# Altium schematic sheet Sheet2.SchDoc
size A
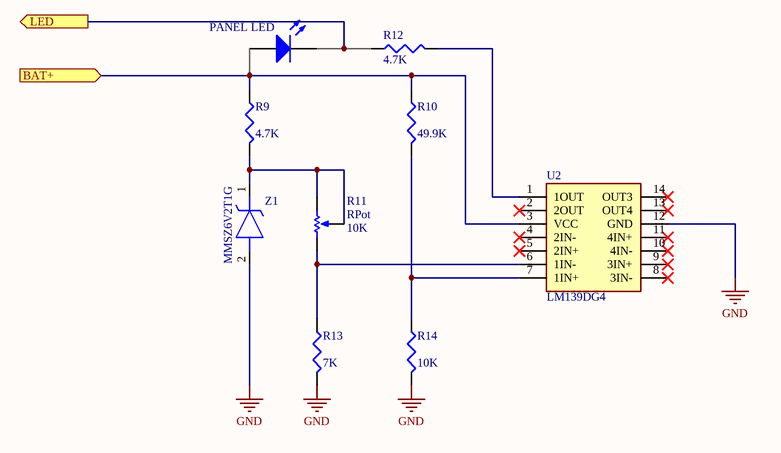
[diagram p0: Sheet2.SchDoc]

## Parts
D5  PANEL LED  [LED-1]  (graphical)
R9  value 4.7K  [RESC1608X55N]  (hidden comment: Res3)
R10  value 49.9K  [RESC1608X55N]  (hidden comment: Res3)
R11  RPot  value 10K  [Bourns_Pot]
R12  value 4.7K  [RESC1608X55N]  (hidden comment: Res3)
R13  value 7K  [RESC1608X55N]  (hidden comment: Res3)
R14  value 10K  [RESC1608X55N]  (hidden comment: Res3)
U2  LM139DG4  [SOIC127P600X175-14N]
Z1  MMSZ6V2T1G  [SOD3716X135N]

## Ports
BAT+ (in), LED (out)

## Nets
GND: R13.2 R14.2 U2.12(GND) Z1.2(A)
BAT+: D5.1(A) R9.1 R10.1 U2.3(VCC) ; port BAT+
LED: D5.2(K) R12.1 ; port LED
NetR9_2: R9.2 R11.2(BOT) R11.3(TAP) Z1.1(K)
NetR10_2: R10.2 R14.1 U2.7(1IN+)
NetR11_1: R11.1(TOP) R13.1 U2.6(1IN-)
NetR12_2: R12.2 U2.1(1OUT)

Not connected (* = marked no-connect by the designer): U2 2(2OUT)* 4(2IN-)* 5(2IN+)* 8(3IN-)* 9(3IN+)* 10(4IN-)* 11(4IN+)* 13(OUT4)* 14(OUT3)*

## Library data of the parts
D5 = LED3: Typical BLUE SiC LED; Published: 8-Jun-2000; LatestRevisionDate: 17-Dec-2003; LatestRevisionNote: PCB Footprint replaced.; DatasheetVersion: 16-Apr-2002; PackageVersion: 16-Apr-2002; PackageReference: 3.5X2.8X1.9; Publisher: Altium Limited; PackageDescription: SM LED; 2 C-Bend Leads; Body 3.5 x 2.8 x 1.9 mm, inc leads (LxWxH typ)
R9 R10 R12-R14 = Res3: Resistor; Published: 8-Jun-2000; LatestRevisionDate: 29-May-2009; LatestRevisionNote: IPC-7351 Footprint Added.; PackageReference: J1-0603; Publisher: Altium Limited; PackageDescription: Chip Resistor
R11 = RPot: Potentiometer; Sim Note: Enter the Resistance value and the set point into parameter fields.; Set Position: 0.5; Published: 8-Jun-2000; LatestRevisionDate: 17-Jul-2002; LatestRevisionNote: Re-released for DXP Platform.; PackageReference: VR5; Publisher: Altium Limited; PackageDescription: Variable Resistor, Thru-Hole; 3 Leads
U2 = LM139DG4: Integrated Circuit; Manufacturer_Name: Texas Instruments; Datasheet Link: http://www.ti.com/lit/gpn/lm139; Height: 1.75mm; Manufacturer_Part_Number: LM139DG4; Arrow Part Number: LM139DG4; Arrow Price/Stock: https://www.arrow.com/en/products/lm139dg4/texas-instruments; Mouser Part Number: 595-LM139DG4; Mouser Price/Stock: https://www.mouser.co.uk/ProductDetail/Texas-Instruments/LM139DG4?qs=pZC5fsuWujF2%252BfnPhylc7Q%3D%3D
Z1 = MMSZ6V2T1G: Zener Diode; Manufacturer_Name: ON Semiconductor; Datasheet Link: http://www.onsemi.com/pub/Collateral/MMSZ2V4T1-D.PDF; Height: 1.35mm; Manufacturer_Part_Number: MMSZ6V2T1G; Arrow Part Number: MMSZ6V2T1G; Arrow Price/Stock: https://www.arrow.com/en/products/mmsz6v2t1g/on-semiconductor; Mouser Part Number: 863-MMSZ6V2T1G; Mouser Price/Stock: https://www.mouser.com/Search/Refine.aspx?Keyword=863-MMSZ6V2T1G